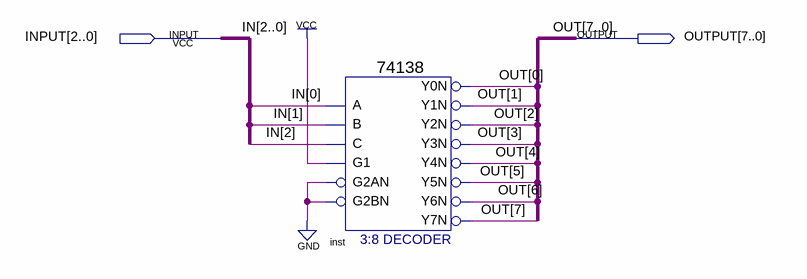
[diagram p0: schematic sheet]
// Quartus schematic 3-8Decoder.bdf as structural Verilog: 1 symbols, 2 pins
module \3-8Decoder  (
  input  [2:0] INPUT,
  output [7:0] OUTPUT
);

  \74138  inst (
    .A(INPUT[0]), .B(INPUT[1]), .G1(1'b1), .C(INPUT[2]), .G2AN(1'b0), .G2BN(1'b0), .Y0N(OUTPUT[0]),
    .Y1N(OUTPUT[1]), .Y2N(OUTPUT[2]), .Y3N(OUTPUT[3]), .Y4N(OUTPUT[4]), .Y5N(OUTPUT[5]), .Y6N(OUTPUT[6]),
    .Y7N(OUTPUT[7]));

  // Other names for the same wires on the sheet: IN[2:0] = INPUT; OUT[7:0] = OUTPUT
endmodule
